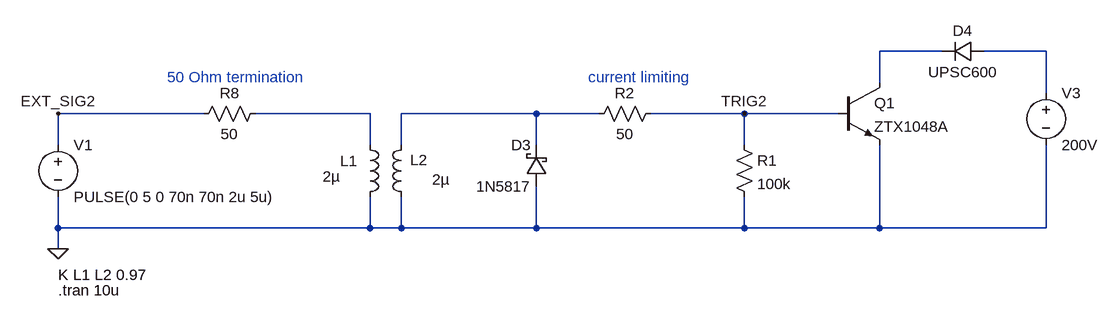
[diagram p0: schematic tigger_filter_2.asc]
tigger_filter_2.asc, the LTspice schematic file:
Version 4.1
SHEET 1 2648 880
WIRE 2400 336 2304 336
WIRE 2560 336 2464 336
WIRE 2304 384 2304 336
WIRE 2560 400 2560 336
WIRE 1264 432 1040 432
WIRE 1520 432 1344 432
WIRE 1776 432 1568 432
WIRE 1872 432 1776 432
WIRE 2096 432 1952 432
WIRE 2240 432 2096 432
WIRE 1040 480 1040 432
WIRE 1520 480 1520 432
WIRE 1568 480 1568 432
WIRE 1776 480 1776 432
WIRE 2096 480 2096 432
WIRE 1040 608 1040 560
WIRE 1520 608 1520 560
WIRE 1520 608 1040 608
WIRE 1568 608 1568 560
WIRE 1568 608 1520 608
WIRE 1776 608 1776 544
WIRE 1776 608 1568 608
WIRE 2096 608 2096 560
WIRE 2096 608 1776 608
WIRE 2304 608 2304 480
WIRE 2304 608 2096 608
WIRE 2560 608 2560 480
WIRE 2560 608 2304 608
WIRE 1040 640 1040 608
FLAG 1040 640 0
FLAG 2096 432 TRIG2
FLAG 1040 432 EXT_SIG2
SYMBOL res 1968 416 R90
WINDOW 0 0 56 VBottom 2
WINDOW 3 32 56 VTop 2
SYMATTR InstName R2
SYMATTR Value 50
SYMBOL npn 2240 384 R0
SYMATTR InstName Q1
SYMATTR Value ZTX1048A
SYMBOL voltage 2560 384 R0
WINDOW 123 0 0 Left 0
WINDOW 39 0 0 Left 0
SYMATTR InstName V3
SYMATTR Value 200V
SYMBOL ind 1504 464 R0
WINDOW 0 -30 41 Left 2
WINDOW 3 -57 65 Left 2
SYMATTR InstName L1
SYMATTR Value 2µ
SYMATTR Type ind
SYMATTR SpiceLine Rser=0.7 Cpar=2p
SYMBOL ind 1584 464 M0
WINDOW 0 -25 39 Left 2
WINDOW 3 -59 69 Left 2
SYMATTR InstName L2
SYMATTR Value 2µ
SYMATTR Type ind
SYMATTR SpiceLine Rser=0.7 Cpar=2p
SYMBOL res 1360 416 R90
WINDOW 0 0 56 VBottom 2
WINDOW 3 32 56 VTop 2
SYMATTR InstName R8
SYMATTR Value 50
SYMBOL schottky 1792 544 R180
WINDOW 0 24 64 Left 2
WINDOW 3 24 0 Left 2
SYMATTR InstName D3
SYMATTR Value 1N5817
SYMBOL diode 2464 320 R90
WINDOW 0 0 32 VBottom 2
WINDOW 3 32 32 VTop 2
SYMATTR InstName D4
SYMATTR Value UPSC600
SYMBOL res 2080 464 R0
SYMATTR InstName R1
SYMATTR Value 100k
SYMBOL voltage 1040 464 R0
WINDOW 123 0 0 Left 0
WINDOW 39 0 0 Left 0
SYMATTR InstName V1
SYMATTR Value PULSE(0 5 0 70n 70n 2u 5u)
TEXT 1040 680 Left 2 !K L1 L2 0.97
TEXT 1040 704 Left 2 !.tran 10u
TEXT 1208 376 Left 2 ;50 Ohm termination
TEXT 1856 376 Left 2 ;current limiting

The netlist it stands for:
* tigger_filter_2.asc
R2 TRIG2 N004 50
Q1 N001 TRIG2 0 0 ZTX1048A
V3 N002 0 200V
L1 N003 0 2µ Rser=0.7 Cpar=2p
L2 N004 0 2µ Rser=0.7 Cpar=2p
R8 N003 EXT_SIG2 50
D3 0 N004 1N5817
D4 N002 N001 UPSC600
R1 TRIG2 0 100k
V1 EXT_SIG2 0 PULSE(0 5 0 70n 70n 2u 5u)
.model D D
.lib standard.dio
.model NPN NPN
.model PNP PNP
.lib standard.bjt
K L1 L2 0.97
.tran 10u
* 50 Ohm termination
* current limiting
.backanno
.end